# EAGLE design SparkFun_IR_Thermometer_Eval-MLX90614 (EAGLE 7.2.0)
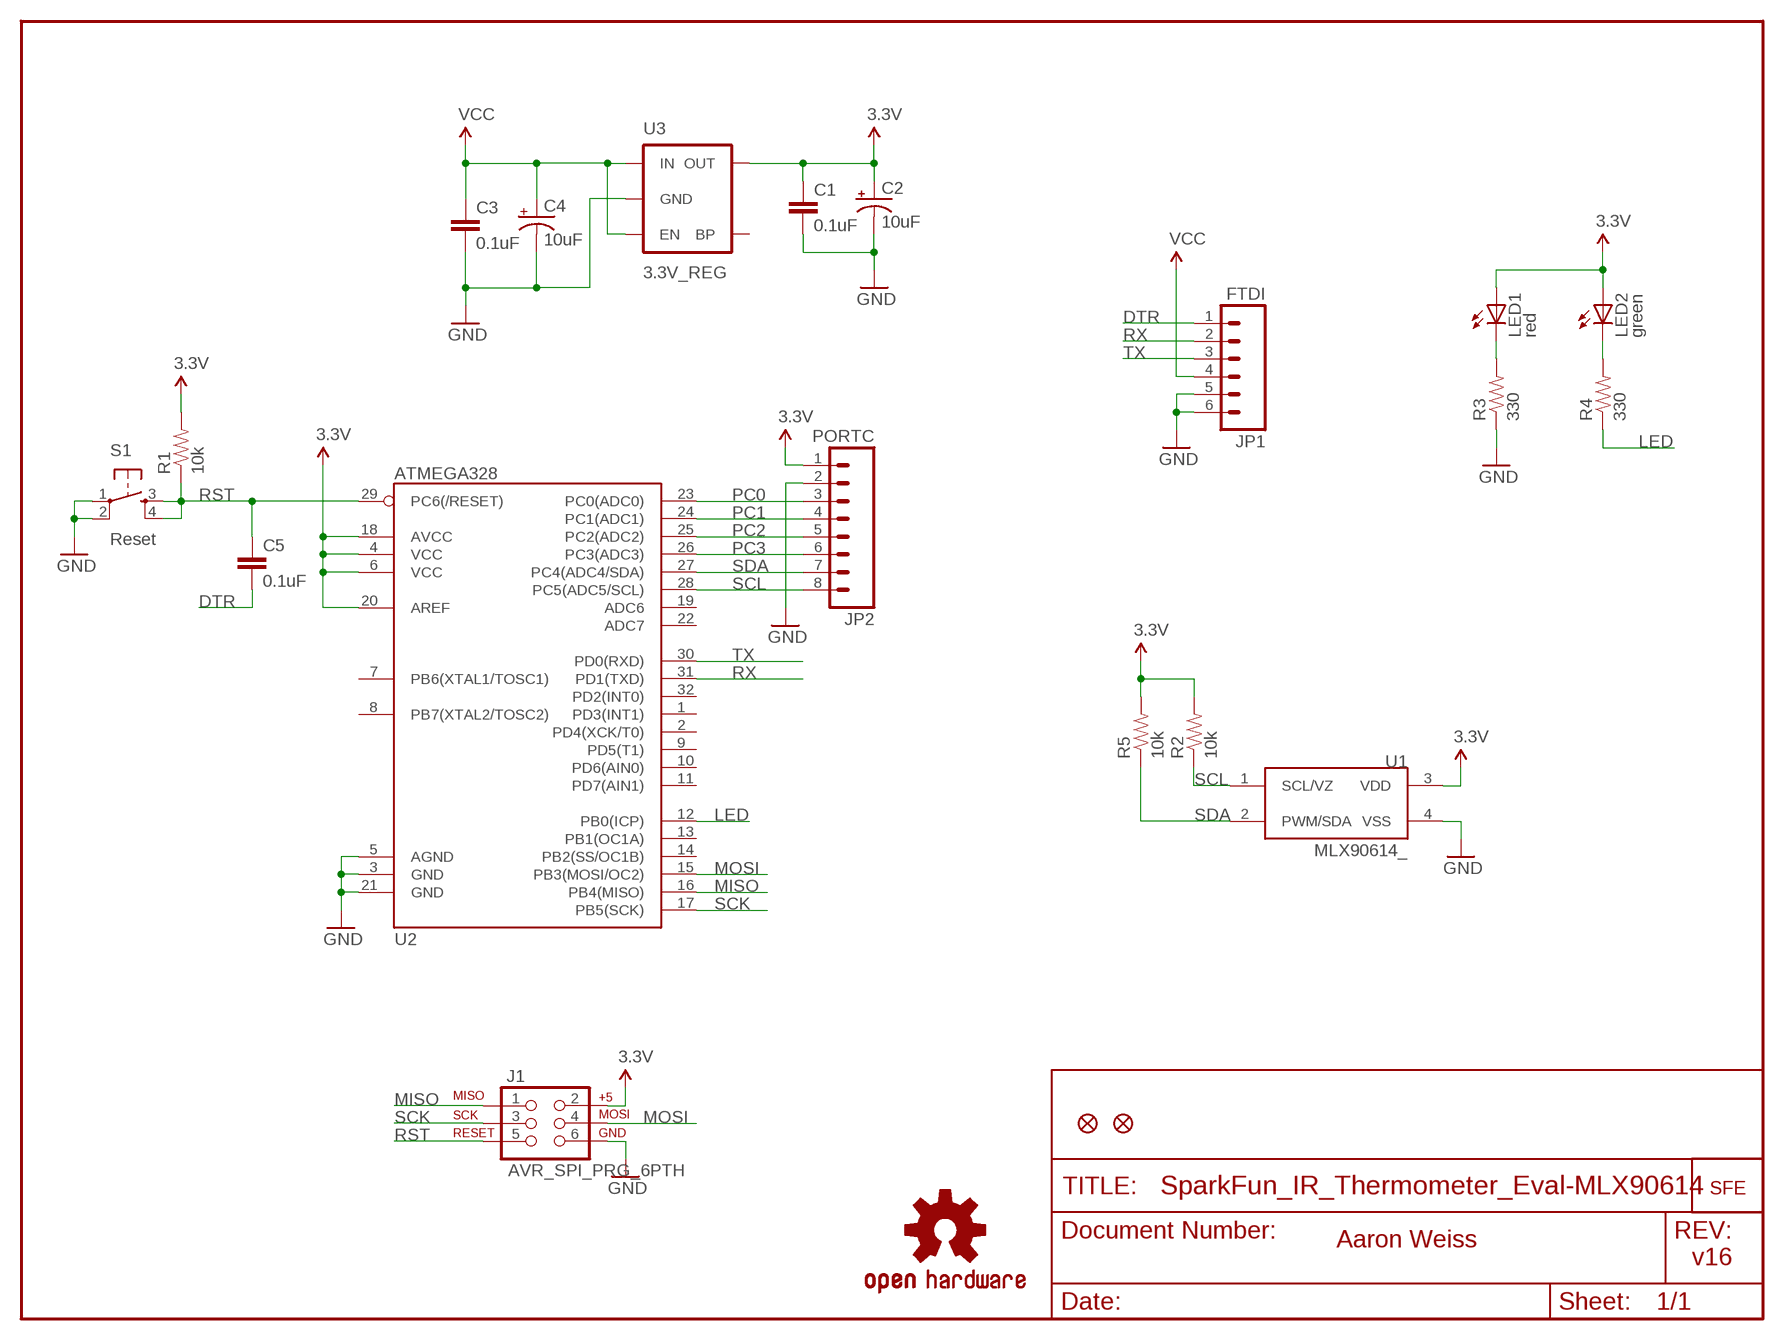
[diagram p0: schematic, sheet 1]

## Parts
C1  0.1uF  CAP0402-CAP  [0402-CAP]
C2  10uF  CAP_POL1206  [EIA3216]
C3  0.1uF  CAP0402-CAP  [0402-CAP]
C4  10uF  CAP_POL1206  [EIA3216]
C5  0.1uF  CAP0402-CAP  [0402-CAP]
J1  AVR_SPI_PRG_6PTH  [2X3]
JP1  FTDI  M06SIP  [1X06]
JP2  PORTC  M08  [1X08]
JP3  FIDUCIAL1X2.5  [FIDUCIAL-1X2.5]
JP4  LOGO-SFESK  [SFE-LOGO-FLAME]
JP5  FIDUCIAL1X2.5  [FIDUCIAL-1X2.5]
LED1  red  LED0603  [LED-0603]
LED2  green  LED0603  [LED-0603]
R1  10k  RESISTOR0402-RES  [0402-RES]
R2  10k  RESISTOR0402-RES  [0402-RES]
R3  330  RESISTOR0402-RES  [0402-RES]
R4  330  RESISTOR0402-RES  [0402-RES]
R5  10k  RESISTOR0402-RES  [0402-RES]
S1  Reset  TAC_SWITCHSMD  [TACTILE_SWITCH_SMD]
U1  MLX90614_  [TO-39]
U2  ATMEGA328  ATMEGA168  [TQFP32-08]
U3  3.3V_REG  V_REG_LDOSMD  [SOT23-5]
U$1  OSHW-LOGOS  [OSHW-LOGO-S]

## Nets
3.3V: C1.1 C2.A(+) J1.2 JP2.1 LED1.A LED2.A R1.2 R2.2 R5.2 U1.3(VDD) U2.4(VCC) U2.6(VCC) U2.18(AVCC) U2.20(AREF) U3.5(OUT)
DTR: C5.2 JP1.1
GND: C1.2 C2.C(-) C3.2 C4.C(-) J1.6 JP1.5 JP1.6 JP2.2 R3.1 S1.1 S1.2 U1.4(VSS) U2.3(GND) U2.5(AGND) U2.21(GND) U3.2(GND)
LED: R4.1 U2.12(PB0(ICP))
MISO: J1.1 U2.16(PB4(MISO))
MOSI: J1.4 U2.15(PB3(MOSI/OC2))
N$2: LED1.C R3.2
N$3: LED2.C R4.2
PC0: JP2.3 U2.23(PC0(ADC0))
PC1: JP2.4 U2.24(PC1(ADC1))
PC2: JP2.5 U2.25(PC2(ADC2))
PC3: JP2.6 U2.26(PC3(ADC3))
RST: C5.1 J1.5 R1.1 S1.3 S1.4 U2.29(PC6(/RESET))
RX: JP1.2 U2.31(PD1(TXD))
SCK: J1.3 U2.17(PB5(SCK))
SCL: JP2.8 R2.1 U1.1(SCL/VZ) U2.28(PC5(ADC5/SCL))
SDA: JP2.7 R5.1 U1.2(PWM/SDA) U2.27(PC4(ADC4/SDA))
TX: JP1.3 U2.30(PD0(RXD))
VCC: C3.1 C4.A(+) JP1.4 U3.1(IN) U3.3(EN)
Unconnected: U2.1(PD3(INT1)) U2.2(PD4(XCK/T0)) U2.7(PB6(XTAL1/TOSC1)) U2.8(PB7(XTAL2/TOSC2)) U2.9(PD5(T1)) U2.10(PD6(AIN0)) U2.11(PD7(AIN1)) U2.13(PB1(OC1A)) U2.14(PB2(SS/OC1B)) U2.19(ADC6) U2.22(ADC7) U2.32(PD2(INT0)) U3.4(BP)

## Notes on the sheet
- Aaron Weiss
- v16

## Library data of the parts
C1 C3 C5 = SparkFun:CAP: Capacitor Standard 0603 ceramic capacitor, and 0.1" leaded capacitor.
C2 C4 = SparkFun:CAP_POL: Capacitor Polarized These are standard SMD and PTH capacitors. Normally 10uF, 47uF, and 100uF in electrolytic and tantalum varieties. Always verify the external diameter of the through hole cap, it varies with capacity, voltage, and manufacturer. The EIA devices should be standard.
J1 = SparkFun:AVR_SPI_PRG_6: AVR ISP 6 Pin This is the reduced ISP connector for AVR programming. Common on Arduino. This footprint will take up less PCB space and can be used with a 10-pin to 6-pin adapter such as SKU: BOB-08508
JP1 = SparkFun:M06: Header 6 Standard 6-pin 0.1" header. Use with straight break away headers (SKU : PRT-00116), right angle break away headers (PRT-00553), swiss pins (PRT-00743), machine pins (PRT-00117), and female headers (PRT-00115). Molex polarized connector foot print use with SKU : PRT-08094 with associated crimp pins and housings. NOTES ON THE VARIANTS LOCK and LOCK_LONGPADS... This footprint was designed to help hold the alignment of a through-hole component (i.e. 6-pin header) while soldering it into place. You may notice that each hole has been shifted either up or down by 0.005 of an inch from it's more standard position (which is a perfectly straight line). This slight alteration caused the pins (the squares in the middle) to touch the edges of the holes. Because they are alternating, it causes a "brace" to hold the component in place. 0.005 has proven to be the perfect amount of "off-center" position when using our standard breakaway headers. Although looks a little odd when you look at the bare footprint, once you have a header in there, the alteration is very hard to notice. Also, if you push a header all the way into place, it is covered up entirely on the bottom side. This idea of altering the position of holes to aid alignment will be further integrated into the Sparkfun Library for other footprints. It can help hold any component with 3 or more connection pins.
JP2 = SparkFun:M08: Header 8 Standard 8-pin 0.1" header. Use with straight break away headers (SKU : PRT-00116), right angle break away headers (PRT-00553), swiss pins (PRT-00743), machine pins (PRT-00117), and female headers (PRT-00115).
JP3 JP5 = abes:FIDUCIAL: Fiducial Alignment Points Various fiducial points for machine vision alignment.
JP4 = SparkFun:LOGO-SFE: Spark Fun Electronics PCB Logo This is the standard Spark Fun Electronics PCB logo.
LED1 LED2 = SparkFun:LED: LEDs Standard schematic elements and footprints for 5mm, 3mm, 1206, and 0603 sized LEDs. 5mm - Spark Fun Electronics SKU : COM-00529 (and others)
R1-R5 = SparkFun:RESISTOR: Resistor Basic schematic elements and footprints for 0603, 1206, and PTH 1/10th watt (small) resistors.
S1 = SparkFun:TAC_SWITCH: Momentary Switch Button commonly used for reset or general input. Spark Fun Electronics SKU : COM-00097
U1 = SparkFun:MLX90614: Melexis IR Thermometer
U2 = SparkFun:ATMEGA168
U3 = SparkFun:V_REG_LDO: Voltage Regulator LDO Standard 150mA LDO voltage regulator in SOT-23 layout. Micrel part MIC5205. BP (by-pass) pin is used to lower output noise with 470pF cap.
U$1 = SparkFun:OSHW-LOGO: Open Source Hardware Logo This logo indicates the piece of hardware it is found on incorporates a OSHW license and/or adheres to the definition of open source hardware found here: http://freedomdefined.org/OSHW

## Board
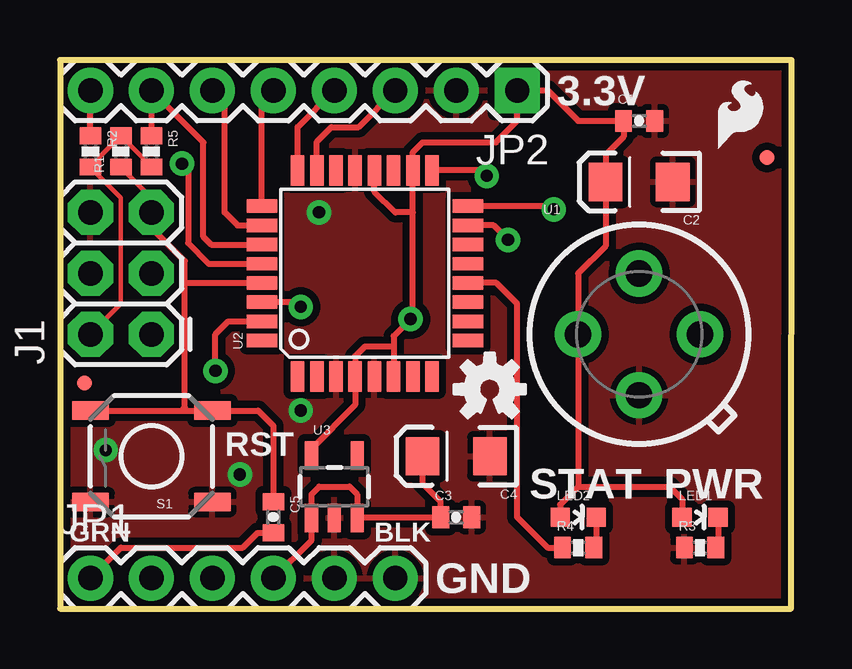
[diagram p1: board, top side]
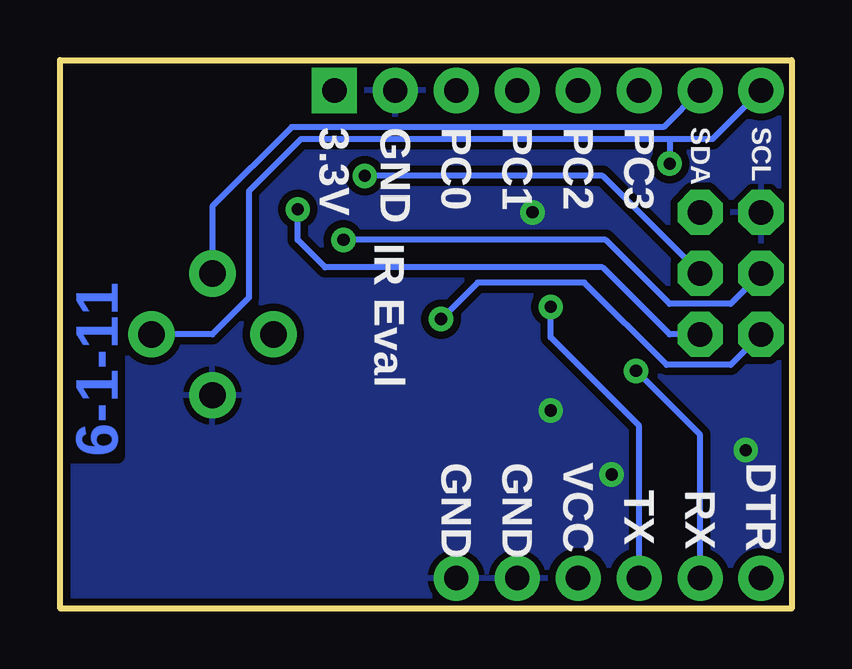
[diagram p2: board, bottom side, seen from below]

Size 30.48 x 22.86 mm. Coordinates in mm from the lower left corner, seen from the top.
Outline: 0,0 30.46,0 30.48,22.86 0,22.86 0,0
Copper layers (1*16): Top 0.035mm / dielectric 1.5mm / Bottom 0.035mm
Design rules "SparkFun": minimum track width 8mil, minimum drill 20mil, track to track 8mil, track to pad 8mil, pad to pad 8mil, via to via 8mil, smd to smd 8mil, copper to edge 8mil, drill to drill 8mil, minimum pad ring 12mil, minimum via ring 10mil, stop-mask expansion 4mil, vias tented up to drill 20mil, thermal gap 10mil

### Footprints (pad centres in the part's own frame; a part is rotated, then mirrored left to right if it is on the bottom)
0402-CAP = smd 0.7 x 0.9: 1 -0.65,0; 2 0.65,0
EIA3216 = smd 1.4 x 1.6: A 1.4,0; C -1.4,0
2X3 = drill 1.016 pad 1.88 octagon: 1 0,0; 2 0,2.54; 3 2.54,0; 4 2.54,2.54; 5 5.08,0; 6 5.08,2.54
1X06 = drill 1.016 pad 1.88: 1 0,0; 2 2.54,0; 3 5.08,0; 4 7.62,0; 5 10.16,0; 6 12.7,0
1X08 = drill 1.016 pad 1.88 square: 1 0,0 | drill 1.016 pad 1.88: 2 2.54,0; 3 5.08,0; 4 7.62,0; 5 10.16,0; 6 12.7,0; 7 15.24,0; 8 17.78,0
FIDUCIAL-1X2.5 = smd 0.635 x 0.635: 1 0,0
LED-0603 = smd 0.8 x 0.8: A 0,-0.75; C 0,0.75
0402-RES = smd 0.7 x 0.9: 1 -0.65,0; 2 0.65,0
TACTILE_SWITCH_SMD = smd 1.524 x 0.762: 1 -2.54,1.905; 2 2.54,1.905; 3 -2.54,-1.905; 4 2.54,-1.905
TO-39 = drill 1.1 pad 1.93: 1 2.54,0; 2 0,2.54; 3 -2.54,0; 4 0,-2.54
TQFP32-08 = smd 1.27 x 0.559: 1 -4.293,2.8; 2 -4.293,2; 3 -4.293,1.2; 4 -4.293,0.4; 5 -4.293,-0.4; 6 -4.293,-1.2; 7 -4.293,-2; 8 -4.293,-2.8; 17 4.293,-2.8; 18 4.293,-2; 19 4.293,-1.2; 20 4.293,-0.4; 21 4.293,0.4; 22 4.293,1.2; 23 4.293,2; 24 4.293,2.8 | smd 0.559 x 1.27: 9 -2.8,-4.293; 10 -2,-4.293; 11 -1.2,-4.293; 12 -0.4,-4.293; 13 0.4,-4.293; 14 1.2,-4.293; 15 2,-4.293; 16 2.8,-4.293; 25 2.8,4.293; 26 2,4.293; 27 1.2,4.293; 28 0.4,4.293; 29 -0.4,4.293; 30 -1.2,4.293; 31 -2,4.293; 32 -2.8,4.293
SOT23-5 = smd 0.55 x 1.2: 1 -0.95,-1.3; 2 0,-1.3; 3 0.95,-1.3; 4 0.95,1.3; 5 -0.95,1.3

### Placement (x,y rotation side)
C1  24.13,20.32 0 top
C2  24.13,17.78 180 top
C3  16.51,3.81 0 top
C4  16.51,6.35 180 top
C5  8.89,3.81 270 top
J1  3.81,11.43 90 top
JP1  1.27,1.27 0 top
JP2  19.05,21.59 180 top
JP3  1.02,9.4 0 top
JP4  27.43,19.18 0 top
JP5  29.46,18.8 0 top
LED1  26.67,3.81 270 top
LED2  21.59,3.81 270 top
R1  2.54,19.05 90 top
R2  1.27,19.05 270 top
R3  26.67,2.54 0 top
R4  21.59,2.54 0 top
R5  3.81,19.05 270 top
S1  3.81,6.35 180 top
U1  24.13,11.43 0 top
U2  12.7,13.97 90 top
U3  11.43,5.08 0 top
U$1  17.91,9.14 0 top

### Tracks (layer width: path | path; a pad name or v marks a point on that pad's centre or on a via)
3.3V  (via drill 0.51)
  Top 0.178: J1.2 2.54,12.7 2.54,17.13 R2.2 | 1.27,18.43 R1.2 3.81,18.43
  Top 0.254: LED2.A 20.84,4.33 21.59,5.08 | LED1.A 25.92,4.56 25.4,5.08 21.59,5.08 | 21.59,5.08 U1.3 21.59,13.97 22.73,15.11 C2.A 22.73,18.92 23.48,19.67 C1.1 21.59,20.32 20.32,21.59 JP2.1 19.05,20.32 18.16,19.43 15.11,19.43 14.7,19.02 U2.18 14.7,16.51 | U2.20 13.1,17.38 13.97,16.51 14.7,16.51 | 14.7,16.51 14.7,12.16 v14.61,12.06 13.9,11.36 13.9,10.92 | 13.9,10.92 U2.6 | 13.9,10.92 12.7,10.92 12.3,10.52 U2.4 12.3,8.49 10.48,6.67 U3.5 | R2.2 1.27,18.43 | 3.81,18.43 R5.2
  Bottom 0.254: J1.2 2.54,10.16 5.21,10.16 8.64,13.59 13.08,13.59 v14.61,12.06
DTR
  Top 0.254: JP1.1 2.54,2.54 7.62,2.54 8.24,3.16 C5.2
GND  (via drill 0.51)
  other vias: 1.91,6.6 10.03,8.26 10.79,16.51 7.49,5.59
  pour Top (isolate 0.305): 0,22.86 0,0 30.48,0 30.48,22.86
  pour Bottom (isolate 0.305): 0,22.86 0,0 30.48,0 30.48,22.86
LED
  Top 0.254: R4.1 20.32,2.54 19.05,3.81 19.05,12.7 18.18,13.57 U2.12
MISO  (via drill 0.51)
  Top 0.254: U2.16 20.44,16.77 v20.57,16.64
  Bottom 0.254: J1.1 5.08,11.43 7.87,14.22 19.43,14.22 20.57,15.37 v20.57,16.64
MOSI  (via drill 0.51)
  Top 0.254: U2.15 18.07,15.97 v18.67,15.37
  Bottom 0.254: v18.67,15.37 7.75,15.37 5.08,12.7 2.54,12.7 J1.4
N$2
  Top 0.254: LED1.C 27.42,2.64 R3.2
N$3
  Top 0.254: LED2.C 22.34,2.64 R4.2
PC0
  Top 0.254: U2.23 10.7,19.46 11.3,20.07 12.45,20.07 JP2.3
PC1
  Top 0.254: U2.24 9.9,20.06 JP2.4
PC2
  Top 0.254: U2.25 8.41,21.11 JP2.5
PC3
  Top 0.254: U2.26 7.4,15.97 6.86,16.51 6.86,21.08 JP2.6
RST
  Top 0.178: J1.5 3.81,17.13 R1.1
  Top 0.254: J1.5 3.81,15.88 5.21,14.48 5.21,13.59 | U2.29 5.23,13.57 5.21,13.59 | S1.4 5.08,8.26 | 5.08,8.26 S1.3 8.26,8.26 8.89,7.62 C5.1 | 5.21,13.59 5.21,8.38 5.08,8.26
RX  (via drill 0.51)
  Top 0.254: U2.31 7.02,11.97 6.48,11.43 v6.48,9.91
  Bottom 0.254: JP1.2 3.81,7.24 v6.48,9.91
SCK  (via drill 0.51)
  Top 0.254: U2.17 17.55,18.26 v17.78,18.03
  Bottom 0.254: v17.78,18.03 7.87,18.03 J1.3
SCL  (via drill 0.51)
  Top 0.254: U2.28 6.2,14.37 5.33,15.24 5.33,18.29 v5.08,18.54 | R2.1 JP2.8
  Bottom 0.254: U1.1 24.13,11.43 22.61,12.95 22.61,17.4 20.45,19.56 5.08,19.56 | JP2.8 3.3,19.56 5.08,19.56 | 5.08,19.56 v5.08,18.54
SDA
  Top 0.254: U2.27 6.29,15.17 5.97,15.49 5.97,19.43 JP2.7 R5.1
  Bottom 0.254: U1.2 24.13,16.76 20.83,20.07 5.33,20.07 JP2.7
TX  (via drill 0.51)
  Top 0.254: U2.30 9.84,12.77 v10.03,12.57
  Bottom 0.254: JP1.3 6.35,7.62 10.03,11.3 v10.03,12.57
VCC
  Top 0.254: JP1.4 10.48,2.86 U3.1 10.48,4.76 10.79,5.08 12.06,5.08 12.38,4.76 U3.3 12.41,3.81 C3.1 15.86,4.46 15.11,5.21 C4.A

### Text on the board
Bottom: 6-1-11
tPlace: 3.3V | RST | STAT | PWR | GRN | BLK | GND
bPlace: SCL | SDA | PC3 | PC2 | PC1 | PC0 | GND | 3.3V | IR Eval | DTR | VCC | GND | GND | RX | TX